# Altium schematic sheet Perf Board Layout.SchDoc
size A4
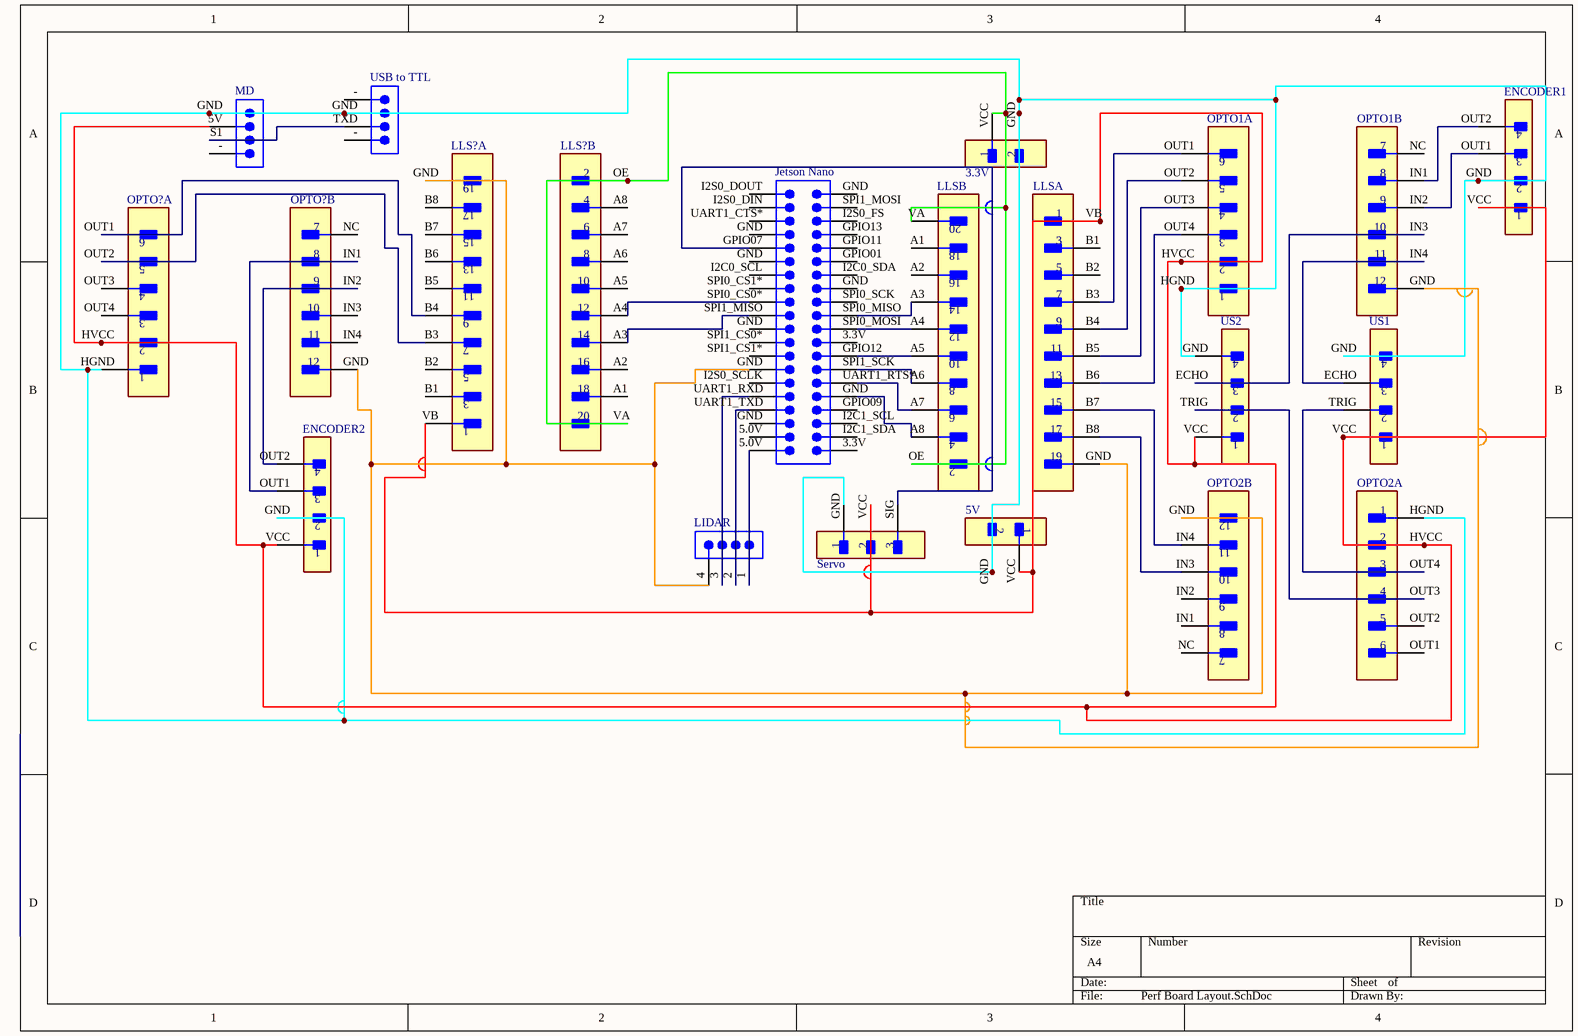
[diagram p0: Perf Board Layout.SchDoc]

## Parts
(Parts that share a designator on the sheet are numbered #1, #2 ... from top to bottom, then left to right.)
3.3V  (no value)  [FP-TMM-102-04-G-S-MFG]
5V  (no value)  [FP-TMM-102-04-G-S-MFG]
ENCODER1  (no value)  [FP-TMM-104-06-L-S-SM-MFG]
ENCODER2  (no value)  [FP-TMM-104-06-L-S-SM-MFG]
Jetson_Nano  (no value)  [SMTC-HMTSW-120-23-X-D-237]
LIDAR  (no value)  [SMTC-TSW-104-08-X-S]
LLS  (no value)  [FP-FTE-110-01-G-DV-ES-A-MFG]  (parts A,B of 2)
LLS?#1  (no value)  [FP-FTE-110-01-G-DV-ES-A-MFG]  (part B of 2)
LLS?#2  (no value)  [FP-FTE-110-01-G-DV-ES-A-MFG]  (part A of 2)
MD  (no value)  [SMTC-TSW-104-08-X-S]
OPTO1  (no value)  [FP-IPL1-106-02-F-D-K-0]  (parts A,B of 2)
OPTO2  (no value)  [FP-IPL1-106-02-F-D-K-0]  (parts A,B of 2)
OPTO?#1  (no value)  [FP-IPL1-106-02-F-D-K-0]  (part B of 2)
OPTO?#2  (no value)  [FP-IPL1-106-02-F-D-K-0]  (part A of 2)
Servo  (no value)  [FP-TMM-103-06-L-S-SM-P-TR-MFG]
US1  (no value)  [FP-TMM-104-06-L-S-SM-MFG]
US2  (no value)  [FP-TMM-104-06-L-S-SM-MFG]
USB_to_TTL  (no value)  [SMTC-TSW-104-08-X-S]

## Nets
Net3.3V_GND: 3.3V.GND 5V.GND ENCODER1.GND ENCODER2.GND MD.GND OPTO1.HGND OPTO2.HGND OPTO?#2.HGND Servo.GND US1.GND US2.GND USB_to_TTL.GND
Net3.3V_VCC: 3.3V.VCC LLS.OE LLS.VA LLS?#1.OE LLS?#1.VA
Net5V_VCC: 5V.VCC ENCODER1.VCC ENCODER2.VCC LLS.VB LLS?#2.VB MD.5V OPTO1.HVCC OPTO2.HVCC OPTO?#2.HVCC Servo.VCC US1.VCC US2.VCC
NetENCODER1_OUT1: ENCODER1.OUT1 OPTO1.IN2
NetENCODER1_OUT2: ENCODER1.OUT2 OPTO1.IN1
NetENCODER2_OUT1: ENCODER2.OUT1 OPTO?#1.IN1
NetENCODER2_OUT2: ENCODER2.OUT2 OPTO?#1.IN2
NetJetson_Nano_5.0V: Jetson_Nano.5.0V LIDAR.1
NetJetson_Nano_GND: Jetson_Nano.GND LLS.A8
NetJetson_Nano_GND: Jetson_Nano.GND LIDAR.4 LLS.GND LLS?#2.GND OPTO1.GND OPTO2.GND OPTO?#1.GND  [a separate net that carries the same name]
NetJetson_Nano_GPIO07: Jetson_Nano.GPIO07 Servo.SIG
NetJetson_Nano_GPIO12: Jetson_Nano.GPIO12 LLS.A5
NetJetson_Nano_SPI0_CS0*: Jetson_Nano.SPI0_CS0* LLS?#1.A4
NetJetson_Nano_SPI0_MISO: Jetson_Nano.SPI0_MISO LLS.A3
NetJetson_Nano_SPI0_MOSI: Jetson_Nano.SPI0_MOSI LLS.A4
NetJetson_Nano_SPI1_MISO: Jetson_Nano.SPI1_MISO LLS?#1.A3
NetJetson_Nano_SPI1_SCK: Jetson_Nano.SPI1_SCK LLS.A6
NetJetson_Nano_UART1_RTS*: Jetson_Nano.UART1_RTS* LLS.A7
NetJetson_Nano_UART1_RXD: Jetson_Nano.UART1_RXD LIDAR.3
NetJetson_Nano_UART1_TXD: Jetson_Nano.UART1_TXD LIDAR.2
NetLLS?#2_B3: LLS?#2.B3 OPTO?#2.OUT2
NetLLS?#2_B4: LLS?#2.B4 OPTO?#2.OUT1
NetLLS_B3: LLS.B3 OPTO1.OUT1
NetLLS_B4: LLS.B4 OPTO1.OUT2
NetLLS_B5: LLS.B5 OPTO1.OUT3
NetLLS_B6: LLS.B6 OPTO1.OUT4
NetLLS_B7: LLS.B7 OPTO2.IN4
NetLLS_B8: LLS.B8 OPTO2.IN3
NetMD_S1: MD.S1 USB_to_TTL.TXD
NetOPTO1_IN3: OPTO1.IN3 US2.ECHO
NetOPTO1_IN4: OPTO1.IN4 US1.ECHO
NetOPTO2_OUT3: OPTO2.OUT3 US2.TRIG
NetOPTO2_OUT4: OPTO2.OUT4 US1.TRIG

Not connected (* = marked no-connect by the designer): Jetson_Nano 3.3V(1) GPIO01(29) GPIO09(7) GPIO11(31) GPIO13(33) I2C0_SCL(28) I2C0_SDA(27) I2C1_SCL(5) I2C1_SDA(3) I2S0_DIN(38) I2S0_DOUT(40) I2S0_FS(35) I2S0_SCLK(12) SPI0_CS1*(26) SPI0_SCK(23) SPI1_CS0*(18) SPI1_CS1*(16) SPI1_MOSI(37) UART1_CTS*(36); LLS A1(18) A2(16) B1(3) B2(5); LLS?#1 A1(18) A2(16) A5(10) A6(8) A7(6) A8(4); LLS?#2 B1(3) B2(5) B5(11) B6(13) B7(15) B8(17); MD -(1); OPTO1 NC(7); OPTO2 IN1(8) IN2(9) NC(7) OUT1(6) OUT2(5); OPTO?#1 IN3(10) IN4(11) NC(7); OPTO?#2 OUT3(4) OUT4(3); USB_to_TTL -(1)

## Library data of the parts
3.3V 5V = CMP-02766-001609-1: 2MM TERMINAL STRIP; Max Voltage Rating (AC): 500V; Max Current Rating: 3.9A; Number of Contacts: 2; Gender: Male; Length: 4mm; Termination: Solder; Number of Rows: 1; Depth: 1.97mm; RoHS Compliant: Yes; Orientation: Straight; Packaging: Bulk; Pitch: 2mm; Max Operating Temperature: 125°C; Contact Material: Bronze; Radiation Hardening: No; Contact Plating: Gold; Housing Color: Black; Min Operating Temperature: -55°C; Housing Material: Polymer
ENCODER1 ENCODER2 US1 US2 = 299a8cea1bdcbc3624fe62c390fa72c: 2MM TERMINAL STRIP; Connector Type: Header; Max Current Rating: 3.9A; Number of Positions: 4; Gender: Male; Max Voltage Rating (AC): 500V; Contact Type: Male Pin; Flammability Rating: UL94 V-0; Length: 8mm; Housing Material: Polymer; Contact Finish - Mating: GOLD; Fastening Type: Pull; Max Operating Temperature: 125°C; Contact Shape: Square; Number of Contacts: 4; Series: TMM; Pitch: 2mm; Orientation: Straight; RoHS Compliant: Yes; Lead Free: Lead Free; Contact Material: Bronze; Termination: Solder; Insulation Color: Black; Min Operating Temperature: -55°C; Insulation Material: Polymer; Housing Color: Black; Number of Rows: 1; Packaging: Rail/Tube; Depth: 1.97mm; Contact Plating: Gold; Radiation Hardening: No
Jetson_Nano = SMTC-HMTSW-120-23-X-D-237: Modified .025" SQ Post Header, Through-hole, Vertical, -55 to 125 degC, 2.54 mm Pitch, 40-Pin, Male, RoHS; Manufacturer: Samtec; PartNumber: HMTSW-120-23-F-D-237; Pitch: 2.54 mm; Orientation: Vertical; Mounting Technology: Through-hole; Temperature Range: -55 to 125 degC; ComponentLink2Description: Datasheet; PackageReference: HMTSW-120-23-X-D-237; DatasheetVersion: F-214; PackageDescription: Assembly .025 [.64] SQ. Post Hi-Temp Terminal Strip; ComponentLink2URL: http://www.samtec.com/documents/webfiles/pdf/HMTSW.PDF; ComponentLink3Description: Package Specification; RoHS: True; ComponentLink1Description: Manufacturer URL; PackageVersion: AL, 3/1987; ComponentLink1URL: http://www.samtec.com; ComponentLink3URL: http://www.samtec.com/documents/webfiles/cpdf/HMTSW-XXX-XX-X-X-XXXX-XX-XX-MKT1.pdf
LIDAR MD USB_to_TTL = CMP-1024-00357-1: 0.025" SQ Post Header, Through-hole, Vertical, -55 to 125 degC, 2.54 mm Pitch, 4-Pin, Male, RoHS; Manufacturer: Samtec; PartNumber: TSW-104-08-G-S; Pitch: 2.54 mm; RoHS: True; ComponentLink3URL: http://www.samtec.com/documents/webfiles/cpdf/TSW-XXX-XX-XXX-X-XX-XXX-MKT.pdf; Mounting Technology: Through-hole; ComponentLink2URL: http://www.samtec.com/documents/webfiles/pdf/TSW_TH.PDF; ComponentLink1URL: http://www.samtec.com; ComponentLink3Description: Package Specification; PackageVersion: DM, 8/1988; ComponentLink2Description: Datasheet; PackageReference: TSW-104-08-X-S; PackageDescription: .025[0.64] SQ. Post Terminal Strip Assembly; ComponentLink1Description: Manufacturer URL; Temperature Range: -55 to 125 degC; DatasheetVersion: F-214; Orientation: Vertical
LLS LLS?#1 LLS?#2 = CMP-02766-000044-1: CONN HEADER SMD 20POS 0.8MM; Manufacturer Part Number: FTE-110-01-G-DV-ES-A; Manufacturer: Samtec; Conn Orientation: Vertical; Conn Gender: Male; Standoff Height: 0.12mm; Number Of Contacts: 20; Current Rating: 2.7A; Height: 3.94mm; Category: Conn; Lead Free: Yes; Digikey Description: CONN HEADER SMD 20POS 0.8MM; Contact Material: Gold,Nickel; Automotive: No; Footprint Url: http://suddendocs.samtec.com/prints/fte-1xx-xx-x-dv-xx-a-footprint.pdf; Pitch: 0.8mm; ComponentLink2URL: http://suddendocs.samtec.com/prints/fte-1xx-xx-x-dv-xx-xx-mkt.pdf; Package: 0; Number Of Rows: 2; Device Class L2: Headers and Wire Housings; ComponentLink2Description: Datasheet; Temperature: -55°C to +125°C; Device Class L1: Connectors; Device Class L3: unset; Temperature Range Low: -55°C; Octopart: https://octopart.com/fte-110-01-g-dv-es-a-samtec-17331811; RoHS: TRUE; Temperature Range High: +125°C
OPTO1 OPTO2 OPTO?#1 OPTO?#2 = CMP-02766-000340-1: 6 Position 2 Row .100" (2.54 mm) pitch connector; Gender: Male; Number of Contacts: 12; Pitch: 2.54mm; Radiation Hardening: No; Termination: Solder; Packaging: Bulk; Mount: Surface Mount; Orientation: Straight
Servo = CMP-02766-001540-1: CONN HEADER SMD 3POS 2MM; Max Current Rating: 3.9A; Max Voltage Rating (AC): 500V; Gender: Male; Number of Contacts: 3; Radiation Hardening: No; Max Operating Temperature: 125°C; Lead Free: Lead Free; Contact Plating: Gold; RoHS Compliant: Yes; Length: 6mm; Pitch: 2mm; Orientation: Straight; Housing Color: Black; Depth: 1.97mm; Packaging: Tape and Reel; Number of Rows: 1; Housing Material: Polymer; Contact Material: Bronze; Termination: Solder; Min Operating Temperature: -55°C